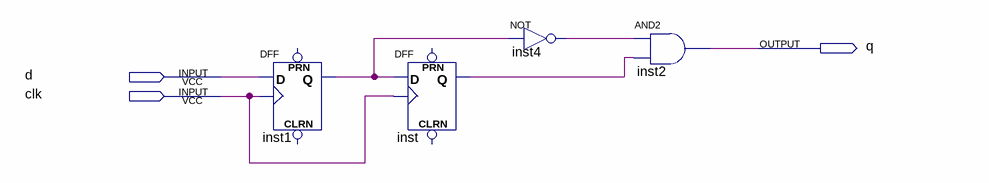
[diagram p0: schematic sheet]
// Quartus schematic imp_ne.bdf as structural Verilog: 4 symbols, 3 pins
module imp_ne (
  input  d,
  input  clk,
  output q
);

  wire inst1_q, inst4_out, inst_q;

  DFF inst1 (.CLK(clk), .D(d), .Q(inst1_q));  // open: CLRN, PRN
  DFF inst (.CLK(clk), .D(inst1_q), .Q(inst_q));  // open: CLRN, PRN
  not inst4 (inst4_out, inst1_q);
  and inst2 (q, inst4_out, inst_q);
endmodule
